# EAGLE design UWB AOA with Display STM32F103C8T6 V1.1 (EAGLE 6.1)
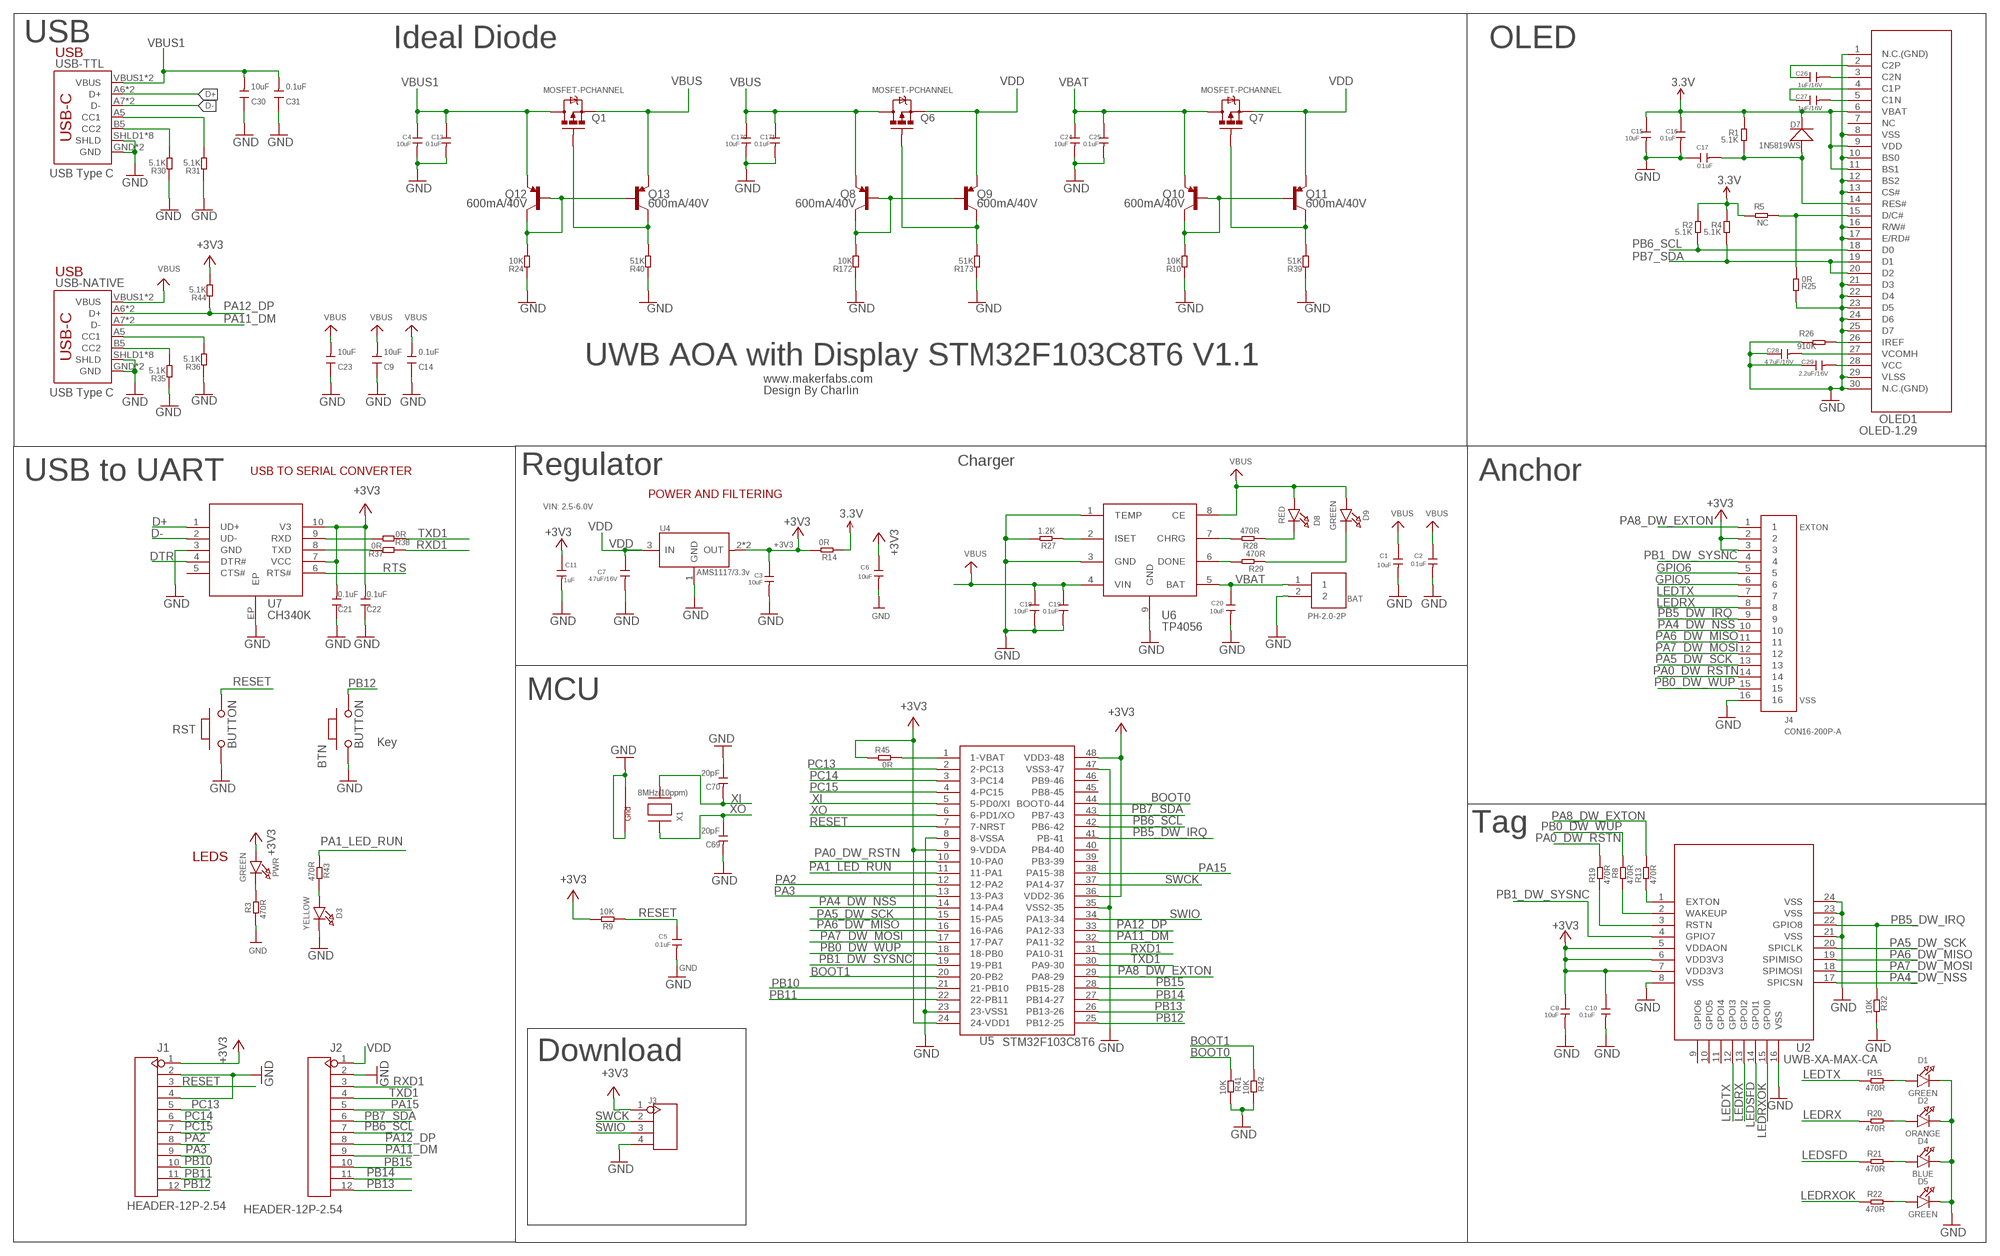
[diagram p0: schematic, sheet 1]

## Parts
BAT  PH-2.0-2P  [PH-2.0-2P]
BTN  BUTTON  PB157  [157SW]
C1  10uF  C-0603  [C0603]
C2  0.1uF  C-0603  [C0603]
C3  10uF  C-0603  [C0603]
C4  10uF  C-0603  [C0603]
C5  0.1uF  C-0603  [C0603]
C6  10uF  C-0603  [C0603]
C7  4.7uF/16V  C-0603  [C0603]
C8  10uF  C-0603  [C0603]
C9  10uF  DISCRETE_C-0603  [DISCRETE_C0603]
C10  0.1uF  C-0603  [C0603]
C11  1uF  C-0603  [C0603]
C13  0.1uF  C-0603  [C0603]
C14  0.1uF  DISCRETE_C-0603  [DISCRETE_C0603]
C15  10uF  C-0603  [C0603]
C16  0.1uF  C-0603  [C0603]
C17  0.1uF  C-0603  [C0603]
C18  10uF  C-0603  [C0603]
C19  0.1uF  C-0603  [C0603]
C20  10uF  C-0603  [C0603]
C21  0.1uF  DISCRETE_C-0603  [DISCRETE_C0603]
C22  0.1uF  DISCRETE_C-0603  [DISCRETE_C0603]
C23  10uF  DISCRETE_C-0603  [DISCRETE_C0603]
C24  10uF  C-0603  [C0603]
C25  0.1uF  C-0603  [C0603]
C26  1uF/16V  C-0603  [C0603]
C27  1uF/16V  C-0603  [C0603]
C28  4.7uF/16V  C-0603  [C0603]
C29  2.2uF/16V  C-0603  [C0603]
C30  10uF  DISCRETE_C-0603  [DISCRETE_C0603]
C31  0.1uF  DISCRETE_C-0603  [DISCRETE_C0603]
C69  20pF  DISCRETE_C-0402  [DISCRETE_C0402]
C70  20pF  DISCRETE_C-0402  [DISCRETE_C0402]
C170  10uF  C-0603  [C0603]
C171  0.1uF  C-0603  [C0603]
D1  GREEN  LED0805_NOOUTLINE  [CHIPLED_0805_NOOUTLINE]
D2  ORANGE  LED0805_NOOUTLINE  [CHIPLED_0805_NOOUTLINE]
D3  YELLOW  LED0805_NOOUTLINE  [CHIPLED_0805_NOOUTLINE]
D4  BLUE  LED0805_NOOUTLINE  [CHIPLED_0805_NOOUTLINE]
D5  GREEN  LED0805_NOOUTLINE  [CHIPLED_0805_NOOUTLINE]
D7  1N5819WS  D'0805'  [SOD323]
D8  RED  LED0805_NOOUTLINE  [CHIPLED_0805_NOOUTLINE]
D9  GREEN  LED0805_NOOUTLINE  [CHIPLED_0805_NOOUTLINE]
J1  HEADER-12P-2.54  [12P-2.54]
J2  HEADER-12P-2.54  [12P-2.54]
J3  HEADER-4P-60/35MILROUND  [4P-65/35ROUND]
J4  CON16-200P-A  [THD16-200P-3250L240W430H]
OLED1  OLED-1.29  [OLED-1.29]
PWR  GREEN  LED0805_NOOUTLINE  [CHIPLED_0805_NOOUTLINE]
Q1  MOSFET-PCHANNEL  [SOT23-3]
Q6  MOSFET-PCHANNEL  [SOT23-3]
Q7  MOSFET-PCHANNEL  [SOT23-3]
Q8  600mA/40V  TRANS_PNP-MMBT4403  [SOT23-3]
Q9  600mA/40V  TRANS_PNP-MMBT4403  [SOT23-3]
Q10  600mA/40V  TRANS_PNP-MMBT4403  [SOT23-3]
Q11  600mA/40V  TRANS_PNP-MMBT4403  [SOT23-3]
Q12  600mA/40V  TRANS_PNP-MMBT4403  [SOT23-3]
Q13  600mA/40V  TRANS_PNP-MMBT4403  [SOT23-3]
R1  5.1K  R-0603  [R0603]
R2  5.1K  R-0603  [R0603]
R3  470R  R-0603  [R0603]
R4  5.1K  R-0603  [R0603]
R5  NC  R-0603  [R0603]
R8  470R  R-0603  [R0603]
R9  10K  R-0603  [R0603]
R10  10K  DISCRETE_R-0603  [DISCRETE_R0603]
R13  470R  R-0603  [R0603]
R14  0R  R-0603  [R0603]
R15  470R  R-0603  [R0603]
R19  470R  R-0603  [R0603]
R20  470R  R-0603  [R0603]
R21  470R  R-0603  [R0603]
R22  470R  R-0603  [R0603]
R24  10K  DISCRETE_R-0603  [DISCRETE_R0603]
R25  0R  R-0603  [R0603]
R26  910K  R-0603  [R0603]
R27  1.2K  R-0603  [R0603]
R28  470R  R-0603  [R0603]
R29  470R  R-0603  [R0603]
R30  5.1K  DISCRETE_R-0603  [DISCRETE_R0603]
R31  5.1K  DISCRETE_R-0603  [DISCRETE_R0603]
R32  10K  R-0603  [R0603]
R35  5.1K  DISCRETE_R-0603  [DISCRETE_R0603]
R36  5.1K  DISCRETE_R-0603  [DISCRETE_R0603]
R37  0R  R-0603  [R0603]
R38  0R  R-0603  [R0603]
R39  51K  DISCRETE_R-0603  [DISCRETE_R0603]
R40  51K  DISCRETE_R-0603  [DISCRETE_R0603]
R41  10K  R-0603  [R0603]
R42  10K  R-0603  [R0603]
R43  470R  R-0603  [R0603]
R44  5.1K  DISCRETE_R-0603  [DISCRETE_R0603]
R45  0R  R-0603  [R0603]
R172  10K  DISCRETE_R-0603  [DISCRETE_R0603]
R173  51K  DISCRETE_R-0603  [DISCRETE_R0603]
RST  BUTTON  PB157  [157SW]
U2  UWB-XA-MAX-CA  [UWB-X1-MAK-CA]
U4  AMS1117/3.3v  LD1117'SOT89'  [SOT89]
U5  STM32F103C8T6  [LQFP48-50P-900L900W160H]
U6  TP4056  [SOP8-1.27P]
U7  CH340K  [ESOP-10-EP-150MIL]
USB-NATIVE  USB_C5  [USB-C-16P-5]
USB-TTL  USB_C5  [USB-C-16P-5]
X1  8MHz(10ppm)  XTAL-4-3225  [NX3225]

## Nets
3.3V: C15.1 C16.1 D7.- OLED1.6(VBAT) OLED1.9(VDD) OLED1.11(BS1) R1.2 R2.2 R4.2 R5.2 R14.1
+3V3: C3.1 C6.1 C8.1 C10.1 C11.1 C21.2 C22.2 J1.1 J3.1 J4.2 J4.3 PWR.A R9.2 R14.2 R44.2 R45.1 U2.5(VDDAON) U2.6(VDD3V3) U2.7(VDD3V3) U4.2(OUT) U4.4(OUT) U5.9(9-VDDA) U5.24(24-VDD1) U5.36(VDD2-36) U5.48(VDD3-48) U7.7(VCC) U7.10(V3)
BOOT0: R41.1 U5.44(BOOT0-44)
BOOT1: R42.1 U5.20(20-PB2)
D+: U7.1(UD+) USB-TTL.A6(D+) USB-TTL.B6(D+)
D-: U7.2(UD-) USB-TTL.A7(D-) USB-TTL.B7(D-)
DTR: U7.4(DTR#)
GND: BAT.2 BTN.1 C1.2 C2.2 C3.2 C4.2 C5.2 C6.2 C7.2 C8.2 C9.1 C10.2 C11.2 C13.2 C14.1 C15.2 C16.2 C17.1 C18.2 C19.2 C20.2 C21.1 C22.1 C23.1 C24.2 C25.2 C28.1 C29.1 C30.1 C31.1 C69.2 C70.1 C170.2 C171.2 D1.C D2.C D3.C D4.C D5.C J1.2 J1.4 J2.2 J3.4 J4.16 OLED1.1(N.C.(GND)) OLED1.8(VSS) OLED1.10(BS0) OLED1.12(BS2) OLED1.13(CS#) OLED1.16(R/W#) OLED1.17(E/RD#) OLED1.21(D3) OLED1.22(D4) OLED1.23(D5) OLED1.24(D6) OLED1.25(D7) OLED1.29(VLSS) OLED1.30(N.C.(GND)) R3.1 R10.1 R24.1 R25.2 R26.2 R27.2 R30.1 R31.1 R32.2 R35.1 R36.1 R39.1 R40.1 R41.2 R42.2 R172.1 R173.1 RST.1 U2.8(VSS) U2.16(VSS) U2.21(VSS) U2.23(VSS) U2.24(VSS) U4.1(GND) U5.8(8-VSSA) U5.23(23-VSS1) U5.35(VSS2-35) U5.47(VSS3-47) U6.1(TEMP) U6.3(GND) U6.9(GND) U7.3(GND) U7.EP USB-NATIVE.GND USB-NATIVE.GND2(GND) USB-NATIVE.SHLD1(SHLD) USB-NATIVE.SHLD2(SHLD) USB-NATIVE.SHLD3(SHLD) USB-NATIVE.SHLD4(SHLD) USB-NATIVE.SHLD5(SHLD) USB-NATIVE.SHLD6(SHLD) USB-NATIVE.SHLD7(SHLD) USB-NATIVE.SHLD8(SHLD) USB-TTL.GND USB-TTL.GND2(GND) USB-TTL.SHLD1(SHLD) USB-TTL.SHLD2(SHLD) USB-TTL.SHLD3(SHLD) USB-TTL.SHLD4(SHLD) USB-TTL.SHLD5(SHLD) USB-TTL.SHLD6(SHLD) USB-TTL.SHLD7(SHLD) USB-TTL.SHLD8(SHLD) X1.2(G2) X1.4(G1)
GPIO5: J4.6
GPIO6: J4.5
LEDRX: J4.8 R20.1 U2.13(GPOI2)
LEDRXOK: R22.1 U2.15(GPOI0)
LEDSFD: R21.1 U2.14(GPOI1)
LEDTX: J4.7 R15.1 U2.12(GPOI3)
N$1: D1.A R15.2
N$3: C17.2 D7.+ OLED1.14(RES#) R1.1
N$4: OLED1.15(D/C#) R5.1 R25.1
N$5: PWR.C R3.2
N$6: C28.2 OLED1.27(VCOMH)
N$7: C26.2 OLED1.3(C2N)
N$8: C29.2 OLED1.28(VCC)
N$9: OLED1.26(IREF) R26.1
N$10: R13.1 U2.1(EXTON)
N$11: R8.1 U2.2(WAKEUP)
N$12: R19.1 U2.3(RSTN)
N$15: Q10.1(B) Q10.3(C) Q11.1(B) R10.2
N$16: D2.A R20.2
N$17: D4.A R21.2
N$18: D5.A R22.2
N$19: C26.1 OLED1.2(C2P)
N$21: C27.1 OLED1.4(C1P)
N$22: C27.2 OLED1.5(C1N)
N$23: R27.1 U6.2(ISET)
N$24: D3.A R43.2
N$25: R31.2 USB-TTL.A5(CC1)
N$26: R30.2 USB-TTL.B5(CC2)
N$28: R45.2 U5.1(1-VBAT)
N$29: R28.2 U6.7(CHRG)
N$30: R29.2 U6.6(DONE)
N$31: D8.C R28.1
N$32: D9.C R29.1
N$33: R36.2 USB-NATIVE.A5(CC1)
N$34: R35.2 USB-NATIVE.B5(CC2)
N$36: Q7.1(G) Q11.3(C) R39.2
N$37: Q12.1(B) Q12.3(C) Q13.1(B) R24.2
N$42: Q1.1(G) Q13.3(C) R40.2
N$46: R38.2 U7.9(RXD)
N$49: R37.2 U7.8(TXD)
N$66: Q8.1(B) Q8.3(C) Q9.1(B) R172.2
N$90: Q6.1(G) Q9.3(C) R173.2
PA0_DW_RSTN: J4.14 R19.2 U5.10(10-PA0)
PA1_LED_RUN: R43.1 U5.11(11-PA1)
PA2: J1.8 U5.12(12-PA2)
PA3: J1.9 U5.13(13-PA3)
PA4_DW_NSS: J4.10 U2.17(SPICSN) U5.14(14-PA4)
PA5_DW_SCK: J4.13 U2.20(SPICLK) U5.15(15-PA5)
PA6_DW_MISO: J4.11 U2.19(SPIMISO) U5.16(16-PA6)
PA7_DW_MOSI: J4.12 U2.18(SPIMOSI) U5.17(17-PA7)
PA8_DW_EXTON: J4.1 R13.2 U5.29(PA8-29)
PA11_DM: J2.9 U5.32(PA11-32) USB-NATIVE.A7(D-) USB-NATIVE.B7(D-)
PA12_DP: J2.8 R44.1 U5.33(PA12-33) USB-NATIVE.A6(D+) USB-NATIVE.B6(D+)
PA15: J2.5 U5.38(PA15-38)
PB0_DW_WUP: J4.15 R8.2 U5.18(18-PB0)
PB1_DW_SYSNC: J4.4 U2.4(GPIO7) U5.19(19-PB1)
PB5_DW_IRQ: J4.9 R32.1 U2.22(GPIO8) U5.41(PB-41)
PB6_SCL: J2.7 OLED1.18(D0) R2.1 U5.42(PB6-42)
PB7_SDA: J2.6 OLED1.19(D1) OLED1.20(D2) R4.1 U5.43(PB7-43)
PB10: J1.10 U5.21(21-PB10)
PB11: J1.11 U5.22(22-PB11)
PB12: BTN.2 J1.12 U5.25(PB12-25)
PB13: J2.12 U5.26(PB13-26)
PB14: J2.11 U5.27(PB14-27)
PB15: J2.10 U5.28(PB15-28)
PC13: J1.5 U5.2(2-PC13)
PC14: J1.6 U5.3(3-PC14)
PC15: J1.7 U5.4(4-PC15)
RESET: C5.1 J1.3 R9.1 RST.2 U5.7(7-NRST)
RTS: U7.6(RTS#)
RXD1: J2.3 R37.1 U5.31(PA10-31)
SWCK: J3.2 U5.37(PA14-37)
SWIO: J3.3 U5.34(PA13-34)
TXD1: J2.4 R38.1 U5.30(PA9-30)
VBAT: BAT.1 C20.1 C24.1 C25.1 Q7.3(D) Q10.2(E) U6.5(BAT)
VBUS: C1.1 C2.1 C9.2 C14.2 C18.1 C19.1 C23.2 C170.1 C171.1 D8.A D9.A Q1.2(S) Q6.3(D) Q8.2(E) Q13.2(E) U6.4(VIN) U6.8(CE) USB-NATIVE.VBUS1(VBUS) USB-NATIVE.VBUS2(VBUS)
VBUS1: C4.1 C13.1 C30.2 C31.2 Q1.3(D) Q12.2(E) USB-TTL.VBUS1(VBUS) USB-TTL.VBUS2(VBUS)
VDD: C7.1 J2.1 Q6.2(S) Q7.2(S) Q9.2(E) Q11.2(E) U4.3(IN)
XI: C70.2 U5.5(5-PD0/XI) X1.3(X2)
XO: C69.1 U5.6(6-PD1/XO) X1.1(X1)
Unconnected: OLED1.7(NC) U2.9(GPIO6) U2.10(GPIO5) U2.11(GPOI4) U5.39(PB3-39) U5.40(PB4-40) U5.45(PB8-45) U5.46(PB9-46) U7.5(CTS#)

## Notes on the sheet
- USB | Ideal Diode | OLED
- USB
- USB Type C
- USB
- UWB AOA with Display STM32F103C8T6 V1.1
- www.makerfabs.com
- USB Type C | Design By Charlin
- Charger
- USB TO SERIAL CONVERTER | Regulator
- USB to UART | Anchor
- POWER AND FILTERING
- VIN: 2.5-6.0V
- MCU
- Key
- Tag
- LEDS
- Download

## Library data of the parts
BAT = Connector:PH-2.0-2P
BTN RST = MySMD:PB157
C1-C8 C10 C11 C13 C15-C20 C24-C29 C170 C171 = Discrete:C*: Ceramic Capacitors
C9 C14 C21-C23 C30 C31 C69 C70 = A9G:DISCRETE_C*: Ceramic Capacitors
D1-D5 D8 D9 PWR = microbuilder:LED: LED 0603 - 0603 Surface Mount Package 2mA: Green LED - Low Power (3.9mcd, 2ma, 1.7Vf) - Digikey: 475-2709-2-ND Orange LED - Low Power (9.8mcd, 2ma, 1.8Vf) - Digikey: 475-1194-2-ND Red LED - Low Power (5mcd, 2ma, 1.8Vf) - Digikey: 475-1195-2-ND Yellow LED - Low Power (7mcd, 2ma, 1.8Vf) - Digikey: 475-1196-2-ND 5mA: Blue LED - Low Power (17mcd, 5ma, 2.9Vf) - Digikey: LNJ937W8CRACT-ND 0805 - 0805 Surface Mount Package 2mA: Red LED (8.8mcd, 2mA, 1.8Vf, Clear) - Low Power [Digikey: 475-2510-1-ND] Green LED (5mcd, 2mA, 1.8Vf, Clear) - Low Power [Digikey: 475-2730-1-ND] Yellow LED (11.3mcd, 2mA, 1.8Vf, Clear) - Low Power [Digikey: 475-2555-1-ND] 20mA: Red LED (104mcd, 20mA, Diffused) - LS R976 [Digikey: 475-1278-6-ND] Red LED (12mcd, 20mA, 2.0Vf, Clear) - APT2012EC [Digikey: 754-1128-1-ND] Green LED (15mcd, 20mA, 2.2Vf, Clear) - APT2012GC [Digikey: 754-1131-1-ND] Orange LED (160mcd, 20mA, 2.1Vf, Clear) - APT2012SECK [Digikey: 754-1130-1-ND] 1206 - 1206 Surface Mount Package Green LED (26mcd, 20mA, Diffused) - LG N971 [Digikey: 475-1407-6-ND] Red LED (15mcd, 20mA, Diffused) - LH N974 [Digikey: 475-1416-6-ND] Cree - Cree High-Power Surface Mount LEDs XPEBWT-L1-0000-00D50 - White 111lm 350mA 2.9Vf 6200K 110° XTEAWT-00-0000-00000LEE3 - White 114lm 350mA 2.85Vf 5000K 115° Everlight - Everlight 45-21 Series Surface Mount LEDs 45-21/QK2C-B2832AC2CB2/2T - Warm White 2000mcd 20mA 3.25Vf 3050K 120° 45-21/LK2C-B38452C4CB2/2T - Nuetral White 2000mcd 20mA 3.25Vf 4150K 120° 45-21/LK2C-B50634C6CB2/2T - Cold White 2200mcd 20mA 3.25Vf 5650K 120° PLCC2 Reverse Mount LS T77K-J1L2-1-0-2-R18-Z - Red 11.25mcd 2mA 1.8Vf 630nm 120° LO T77K-L1M2-24-Z - Orange 19.6mcd 2mA 1.8Vf 606nm 120° LY T77K-K2M1-26-Z - Yellow 15.7mcd 2mA 1.8Vf 587nm 120°
D7 = Discrete:D*
J1 J2 = Connector:HEADER-12P
J3 = Connector:HEADER-4P
J4 = user:CON16-200P-A
OLED1 = sale:OLED-1.29
Q1 Q6 Q7 = User-Submitted:MOSFET-PCHANNEL: Generic PMOSFET IRLML2244 - TRANS-11153 (SOT-23 -20V -4.3A) (1.Gate 2.Source 3.Drain) FQP27P06 - COM-10349 <http://www.sparkfun.com/products/10349> (TO-220 -60V -27A) (1.Gate 2.Source 3.Drain); PROD_ID: TRANS-08285
Q8-Q13 = SparkFun-DiscreteSemi:TRANS_PNP: PNP transistor Current controlled devices typically used to amplify current or used as a switch. SparkFun Products: SparkFun Serial Enabled 16x2 LCD - Red on Black <https://www.sparkfun.com/products/9068> SparkFun Logomatic <https://www.sparkfun.com/products/12772>; PROD_ID: TRANS-09245
R1-R5 R8 R9 R13-R15 R19-R22 R25-R29 R32 R37 R38 R41-R43 R45 = Discrete:R*
R10 R24 R30 R31 R35 R36 R39 R40 R44 R172 R173 = A9G:DISCRETE_R*
U2 = sale:UWB-XA-MAX-CA
U4 = IC:LD1117: Low Drop Fixed And Adjustable Positive Voltage Regulators http://www.datasheetcatalog.org/datasheet/SGSThomsonMicroelectronics/mXuqtqv.pdf
U5 = user:STM32F103C8T6
U6 = self:TP4056
U7 = sale:CH340K
USB-NATIVE USB-TTL = USBC:USB_C: USB Type C 16Pin Connector Super Speed pins not available on the 16-pin purely SMD connector so this part is best for USB 2.0 implementations. D1 and D2 are tied together enabling D+/- no matter which way the cable is plugged into the connector. The two channel configuration pins (CC1/2) are exposed. These are normally connected to ground via 5.1k resistors but can be reconfigured for high current/high power applications.
X1 = adafruit:XTAL-4: Classic 4-pin 3.2 x 2.5mm crystal

## Net classes
0 default: width 0.203 mm

## Board
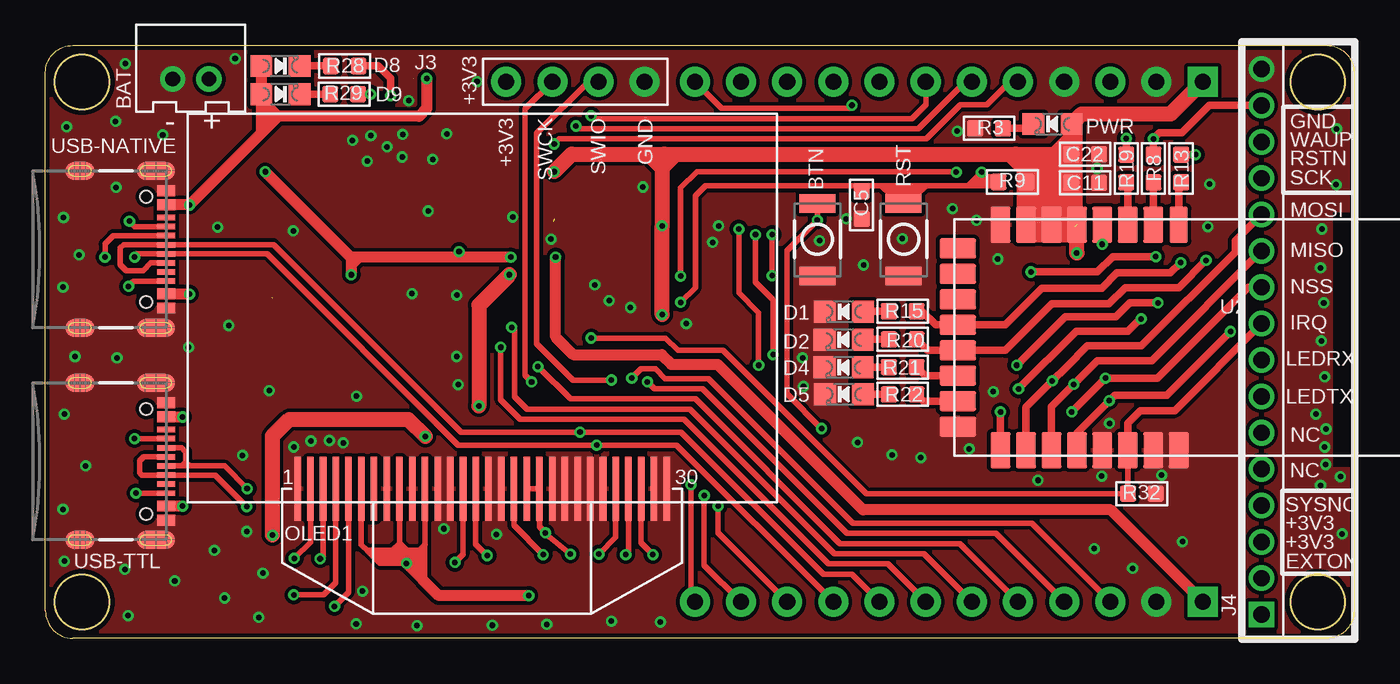
[diagram p1: board, top side]
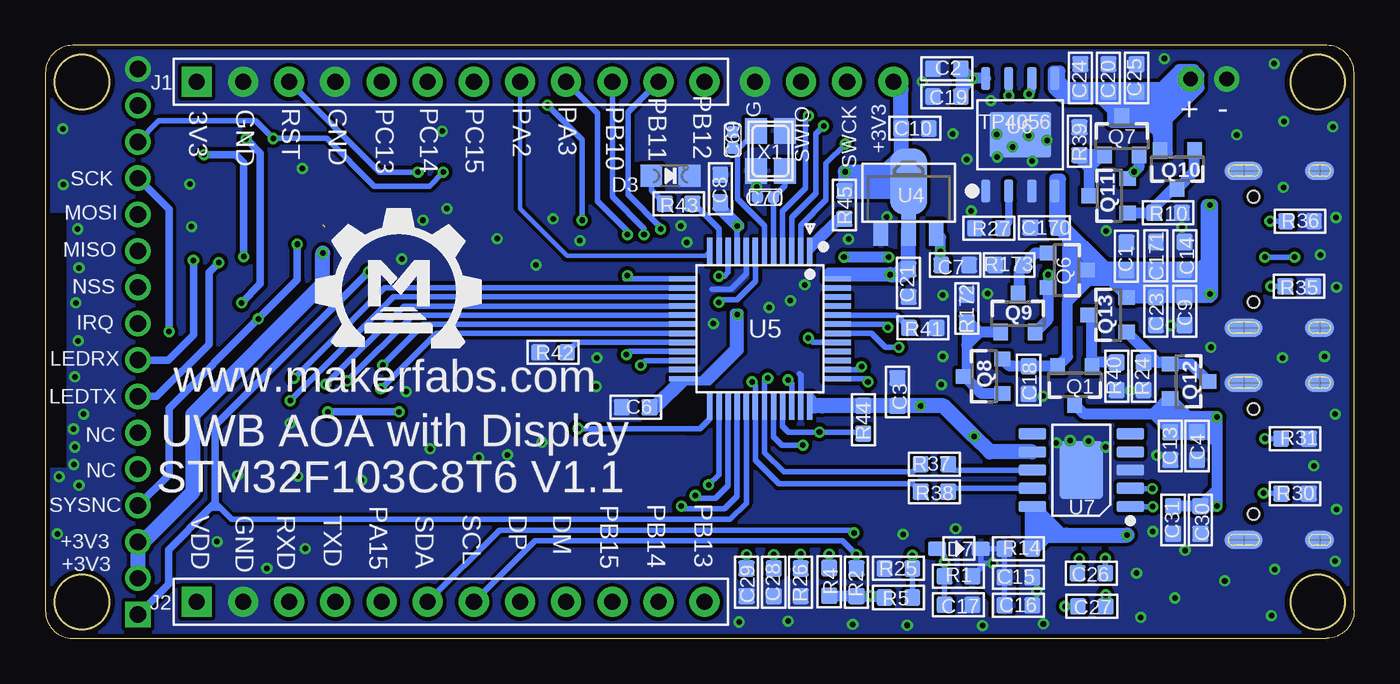
[diagram p2: board, bottom side, seen from below]

Size 72 x 32.6 mm. Coordinates in mm from the lower left corner, seen from the top.
Outline: 72,31.1 72,1.5 arc-90 70.5,0 1.5,0 arc-90 0,1.5 0,31.1 arc-90 1.5,32.6 70.5,32.6 arc-90 72,31.1
Outline: circle at 2,2 radius 1.5
Outline: circle at 2,30.6 radius 1.5
Outline: circle at 70,30.6 radius 1.5
Outline: circle at 70,2 radius 1.5
Copper layers (1*16): Top 0.035mm / dielectric 1.5mm / Bottom 0.035mm
Design rules: minimum track width 10mil, minimum drill 10mil, track to track 8mil, track to pad 8mil, pad to pad 8mil, via to via 8mil, smd to smd 0mil, copper to edge 10mil, drill to drill 8mil, minimum pad ring 10mil, minimum via ring 6mil, stop-mask expansion 4mil, vias tented up to drill 100mil, thermal gap 0mil
tRestrict: area 70.9,9.4 to 72.5,23.4
bRestrict: area 70.9,9.4 to 72.5,23.4

### Footprints (pad centres in the part's own frame; a part is rotated, then mirrored left to right if it is on the bottom)
PH-2.0-2P = drill 0.8 pad 1.4: 1 -1,0; 2 1,0
157SW = smd 1.016 x 1.981: 1 0,0; 2 4,0
C0603 = smd 0.889 x 0.889: 1 -0.762,0; 2 0.762,0
DISCRETE_C0603 = smd 0.889 x 0.889: 1 -0.762,0; 2 0.762,0
DISCRETE_C0402 = smd 0.635 x 0.635: 1 -0.445,0; 2 0.445,0
CHIPLED_0805_NOOUTLINE = smd 1.2 x 1.2: A 0,-1.05; C 0,1.05
SOD323 = smd 1 x 0.8: + -1.2,0; - 1.2,0
12P-2.54 = drill 0.889 pad 1.651 square: 1 0,13.97 | drill 0.889 pad 1.651: 2 0,11.43; 3 0,8.89; 4 0,6.35; 5 0,3.81; 6 0,1.27; 7 0,-1.27; 8 0,-3.81; 9 0,-6.35; 10 0,-8.89; 11 0,-11.43; 12 0,-13.97
4P-65/35ROUND = drill 0.889 pad 1.651: 1 0,3.81; 2 0,1.27; 3 0,-1.27; 4 0,-3.81
THD16-200P-3250L240W430H = drill 0.9 square: 1 -15,0 | drill 0.9: 2 -13,0; 3 -11,0; 4 -9,0; 5 -7,0; 6 -5,0; 7 -3,0; 8 -1,0; 9 1,0; 10 3,0; 11 5,0; 12 7,0; 13 9,0; 14 11,0; 15 13,0; 16 15,0
OLED-1.29 = smd 0.4 x 3.5: 1 -10.15,-9.94; 2 -9.45,-9.94; 3 -8.75,-9.94; 4 -8.05,-9.94; 5 -7.35,-9.94; 6 -6.65,-9.94; 7 -5.95,-9.94; 8 -5.25,-9.94; 9 -4.55,-9.94; 10 -3.85,-9.94; 11 -3.15,-9.94; 12 -2.45,-9.94; 13 -1.75,-9.94; 14 -1.05,-9.94; 15 -0.35,-9.94; 16 0.35,-9.94; 17 1.05,-9.94; 18 1.75,-9.94; 19 2.45,-9.94; 20 3.15,-9.94; 21 3.85,-9.94; 22 4.55,-9.94; 23 5.25,-9.94; 24 5.95,-9.94; 25 6.65,-9.94; 26 7.35,-9.94; 27 8.05,-9.94; 28 8.75,-9.94; 29 9.45,-9.94; 30 10.15,-9.94
SOT23-3 = smd 0.8 x 0.9: 1 -0.95,-1; 2 0.95,-1; 3 0,1.1
R0603 = smd 0.889 x 0.889: 1 -0.762,0; 2 0.762,0
DISCRETE_R0603 = smd 0.889 x 0.889: 1 -0.762,0; 2 0.762,0
UWB-X1-MAK-CA = smd 2 x 1: 1 -6.2,-3.65 | smd 2 x 1.1: 2 -6.2,-5.05; 3 -6.2,-6.45; 4 -6.2,-7.85; 5 -6.2,-9.25; 6 -6.2,-10.65; 7 -6.2,-12.05; 8 -6.2,-13.45; 17 6.2,-13.45; 18 6.2,-12.05; 19 6.2,-10.65; 20 6.2,-9.25; 21 6.2,-7.85; 22 6.2,-6.45; 23 6.2,-5.05; 24 6.2,-3.65 | smd 1.1 x 2: 9 -4.9,-15.8; 10 -3.5,-15.8; 11 -2.1,-15.8; 12 -0.7,-15.8; 13 0.7,-15.8; 14 2.1,-15.8; 15 3.5,-15.8; 16 4.9,-15.8
SOT89 = smd 0.8 x 1.4: 1 -1.524,-1.905; 3 1.524,-1.905 | smd 0.8 x 1.9: 2 0,-1.651 | smd 2.032 x 3.65: 4 0,0.94
LQFP48-50P-900L900W160H = smd 0.3 x 1.5: 1 -2.75,-4.25; 2 -2.25,-4.25; 3 -1.75,-4.25; 4 -1.25,-4.25; 5 -0.75,-4.25; 6 -0.25,-4.25; 7 0.25,-4.25; 8 0.75,-4.25; 9 1.25,-4.25; 10 1.75,-4.25; 11 2.25,-4.25; 12 2.75,-4.25; 25 2.75,4.25; 26 2.25,4.25; 27 1.75,4.25; 28 1.25,4.25; 29 0.75,4.25; 30 0.25,4.25; 31 -0.25,4.25; 32 -0.75,4.25; 33 -1.25,4.25; 34 -1.75,4.25; 35 -2.25,4.25; 36 -2.75,4.25 | smd 1.5 x 0.3: 13 4.25,-2.75; 14 4.25,-2.25; 15 4.25,-1.75; 16 4.25,-1.25; 17 4.25,-0.75; 18 4.25,-0.25; 19 4.25,0.25; 20 4.25,0.75; 21 4.25,1.25; 22 4.25,1.75; 23 4.25,2.25; 24 4.25,2.75; 37 -4.25,2.75; 38 -4.25,2.25; 39 -4.25,1.75; 40 -4.25,1.25; 41 -4.25,0.75; 42 -4.25,0.25; 43 -4.25,-0.25; 44 -4.25,-0.75; 45 -4.25,-1.25; 46 -4.25,-1.75; 47 -4.25,-2.25; 48 -4.25,-2.75
SOP8-1.27P = smd 1.27 x 0.51: 1 -3.1,1.905; 2 -3.1,0.635; 3 -3.1,-0.635; 4 -3.1,-1.905; 5 3.1,-1.905; 6 3.1,-0.635; 7 3.1,0.635; 8 3.1,1.905 | smd 2.5 x 3.4: 9 0,0
ESOP-10-EP-150MIL = smd 1.5 x 0.6: 1 -2.7,2; 2 -2.7,1; 3 -2.7,0; 4 -2.7,-1; 5 -2.7,-2; 6 2.7,-2; 7 2.7,-1; 8 2.7,0; 9 2.7,1; 10 2.7,2 | smd 2.4 x 3.2: EP 0,0
USB-C-16P-5 = smd 0.3 x 1: A5 -1.25,-0.34; A6 -0.25,-0.34; A7 0.25,-0.34; A8 1.25,-0.34; B5 1.75,-0.34; B6 0.75,-0.34; B7 -0.75,-0.34; B8 -1.75,-0.34 | smd 0.6 x 1: GND -3.225,-0.34; GND2 3.225,-0.34; VBUS1 -2.45,-0.34; VBUS2 2.45,-0.34 | smd 1 x 2.1: SHLD1 -4.32,-0.915; SHLD2 4.32,-0.915 | smd 1 x 2.1 bottom: SHLD3 -4.32,-0.915; SHLD4 4.32,-0.915 | smd 1 x 1.6: SHLD5 -4.32,-5.095; SHLD8 4.32,-5.095 | smd 1 x 1.6 bottom: SHLD6 -4.32,-5.095; SHLD7 4.32,-5.095 | hole 0.65: -2.89,-1.445; 2.89,-1.445
NX3225 = smd 1.4 x 1.2: 1 -1.1,-0.8; 2 1.1,-0.8; 3 1.1,0.8; 4 -1.1,0.8

### Placement (x,y rotation side)
BAT  8,30.75 180 top
BTN  42.47,19.91 90 top
C1  12.52,21.01 90 bottom
C2  22.4,31.32 180 bottom
C3  25.12,13.54 90 bottom
C4  8.64,10.57 270 bottom
C5  44.91,23.83 270 top
C6  39.52,12.7 180 bottom
C7  21.95,20.52 0 bottom
C8  34.87,24.73 90 bottom
C9  9.32,17.98 90 bottom
C10  24.16,28.04 0 bottom
C11  57.2,25.04 0 top
C13  10.11,10.57 270 bottom
C14  9.32,21.03 270 bottom
C15  18.47,3.35 0 bottom
C16  18.47,1.8 0 bottom
C17  21.77,1.83 180 bottom
C18  17.91,14.2 270 bottom
C19  22.4,29.79 180 bottom
C20  13.51,30.81 90 bottom
C21  24.51,19.53 90 bottom
C22  57.2,26.62 180 top
C23  10.9,17.98 90 bottom
C24  15.06,30.81 90 bottom
C25  11.96,30.81 90 bottom
C26  14.45,3.58 180 bottom
C27  14.43,1.75 180 bottom
C28  31.93,3.07 90 bottom
C29  33.43,3.07 90 bottom
C30  8.46,6.5 90 bottom
C31  9.96,6.5 90 bottom
C69  34.19,27.4 90 bottom
C70  32.38,24.26 0 bottom
C170  17.04,22.58 180 bottom
C171  10.9,21.03 90 bottom
D1  43.93,17.96 90 top
D2  43.92,16.42 90 top
D3  37.62,25.43 270 bottom
D4  43.91,14.9 90 top
D5  43.93,13.42 90 top
D7  21.74,4.93 0 bottom
D8  12.93,31.47 270 top
D9  12.93,29.92 270 top
J1  49.7,30.6 90 bottom
J2  49.7,2 90 bottom
J3  29.16,30.61 90 top
J4  66.9,16.3 90 top
OLED1  24.03,18.16 0 top
PWR  55.41,28.28 90 top
Q1  15.37,13.94 180 bottom
Q6  15.82,20.24 270 bottom
Q7  12.78,27.58 0 bottom
Q8  20.35,14.4 90 bottom
Q9  18.49,17.83 0 bottom
Q10  9.73,25.83 180 bottom
Q11  13.46,24.33 90 bottom
Q12  9.12,14.12 270 bottom
Q13  13.51,17.78 90 bottom
R1  21.77,3.4 0 bottom
R2  27.38,3.07 270 bottom
R3  51.92,28.04 0 top
R4  28.88,3.1 270 bottom
R5  25.07,2.24 180 bottom
R8  60.96,25.83 90 top
R9  53.2,25.09 0 top
R10  10.24,23.39 180 bottom
R13  62.48,25.83 90 top
R14  18.47,4.93 0 bottom
R15  47.17,17.98 180 top
R19  59.46,25.83 90 top
R20  47.17,16.43 180 top
R21  47.17,14.91 180 top
R22  47.17,13.41 180 top
R24  11.58,14.4 90 bottom
R25  25.07,3.84 180 bottom
R26  30.45,3.07 270 bottom
R27  20.09,22.56 180 bottom
R28  16.46,31.47 0 top
R29  16.43,29.92 0 top
R30  3.25,7.95 180 bottom
R31  3.25,10.97 180 bottom
R32  60.33,7.95 0 top
R35  3.02,19.35 180 bottom
R36  2.97,22.94 180 bottom
R37  23.09,9.58 0 bottom
R38  23.09,8.05 0 bottom
R39  15.11,27.33 270 bottom
R40  13.06,14.4 90 bottom
R41  23.72,17.07 0 bottom
R42  44.07,15.72 180 bottom
R43  37.16,23.9 180 bottom
R44  27,12.01 90 bottom
R45  28.04,23.83 270 bottom
R172  21.31,18.14 270 bottom
R173  18.97,20.52 0 bottom
RST  47.22,19.91 90 top
U2  66,16.54 270 top
U4  24.51,24.18 0 bottom
U5  32.69,17.02 180 bottom
U6  18.36,27.69 90 bottom
U7  15.01,9.25 180 bottom
U$1  [MAKERFABS_0.3]  56.69,16.01 0 bottom
USB-NATIVE  6.99,21.39 270 top
USB-TTL  6.99,9.72 270 top
X1  32.11,26.8 270 bottom

### Tracks (layer width: path | path; a pad name or v marks a point on that pad's centre or on a via)
3.3V  (via drill 0.3)
  Top 0.254: 20.17,4.65 19.99,4.65 19.99,4.72
  Top 0.305: OLED1.6 17.38,5.15 17.7,4.83 | OLED1.11 20.88,5.13 20.85,5.11 | OLED1.9 19.48,4.5 v19.86,4.12 | 17.7,4.83 18.41,4.12 v19.86,4.12 | 20.57,4.83 v19.86,4.12 | 17.7,4.83 20.57,4.83 | 20.57,4.83 20.85,5.11 | 20.85,5.11 20.85,3.1 20.65,3.3 20.65,4.67 20.42,4.45 20.42,3.89 20.17,4.14 20.17,4.65 18.11,4.65 18.36,4.39 19.99,4.39 | 19.05,4.8 19.48,5.23 19.99,4.72
  Top 0.61: v26.59,2.34 21.64,2.34 v19.86,4.12
  Bottom 0.305: C16.1 C15.1 R14.1 D7.- 20.54,4.12 | 20.54,4.12 20.54,3.87 R1.2 | v19.86,4.12 20.54,4.12 | 27.41,2.34 R2.2 | R5.2 v26.59,2.34
  Bottom 0.406: 25.83,2.31 R5.2
  Bottom 0.61: R4.2 27.41,2.34 | R2.2 25.83,2.31
  pour Bottom: 18.77,1.45 18.77,5.13 18.97,5.33 21.01,5.33 21.36,4.98 21.36,3.12 21.21,2.97 20.45,2.97 19.79,2.31 19.79,1.45
+3V3  (via drill 0.3)  (1 unrouted)
  Top 0.813: 34.04,26.62 28.96,26.62 v27.99,25.65 | 34.04,26.62 53.39,26.62 | 53.39,26.62 C22.2 | J1.1 61.9,28.83 57.01,28.83 PWR.A 56.44,28.26 C22.2 | 53.39,26.62 53.96,26.05 R9.2 U2.7 U2.6 U2.5 v56.75,21.19 v56.74,21.18 | C11.1 C22.2 | 33.93,25.88 33.93,26.52 34.04,26.62 | v12.5,5.66 12.5,11.12 13.41,12.04 19.96,12.04 v20.9,11.1 | v25.53,19.99 23.85,18.31 v23.85,12.78 | 33.25,26.57 33.93,25.88 | 33.93,25.88 34.65,26.59 | 56.87,22.15 53.85,22.15 53.85,25.83 53.09,26.59 55.52,26.59 56.64,27.71 56.64,22.63 56.21,22.63 55.85,22.99 55.85,25.96 55.73,26.09 54.53,26.09 54.51,26.06 54.51,23.19 54.56,23.19 55.19,23.82 55.19,25.81 55.14,25.86 | v33.93,17.8 v33.93,22.68 33.93,25.88
  Bottom 0.254: 29.77,13.13 29.94,13.13 | 29.94,13.13 U5.36 | 29.94,13.13 29.9,13.13 29.9,13.16 | v33.93,17.8 33.81,17.8 33.81,17.98 | 33.96,22.48 33.93,22.48 v33.93,22.68 v33.94,22.68 | 35.12,23.95 35.1,23.95 35.1,23.9 | C6.1 38.68,12.78 38.68,12.8
  Bottom 0.305: U5.9 v33.94,22.68 33.94,22.76 | 35.12,23.95 C8.1 34.87,23.62 v33.93,22.68 | U5.48 25.04,19.77 C21.2 | C3.1 v23.85,12.78 | 24.69,20.78 25.22,20.24 28.91,20.24 29.03,20.12 29.03,19.79 25.38,19.79 25.17,19.99 | 24.89,20.27 25.17,19.99 | 25.17,19.99 v25.53,19.99 28.83,19.99 | 33.96,22.48 33.83,22.48 33.71,22.61 33.71,22.73 34.98,24 | U5.24 38.51,12.7 C6.1 | 38.63,12.5 38.35,12.5 36.6,14.25 | 36.6,14.25 37.24,14.25 38.68,12.8 | 29.87,13.13 29.9,13.16 29.92,13.18 | 36.6,14.25 35.56,14.25 33.93,15.88 v33.93,17.8 | 36.96,14.05 35.48,14.05 33.73,15.8 33.73,17.91 33.81,17.98 34.11,17.98 34.19,17.91 34.19,15.95 35.84,14.3 | 29.77,13.13 29.77,13.23 | 29.77,13.23 29.9,13.36 | 29.77,13.23 29.31,12.78 29.26,12.78 | 33.93,22.53 34.01,22.53 35.1,23.62 35.1,23.9 35.1,23.98
  Bottom 0.406: U4.2 24.51,24.54 24.51,24.59 U4.4 | 29.77,13.13 29.57,12.93 | U7.10 R14.2 | 16.18,5.66 17.4,5.66 17.93,5.13 17.93,7.32 17.5,7.32 15.85,5.66 16.18,5.66 | 16.18,5.66 17.55,7.04 17.55,5.44 17.58,5.41 17.58,5.51 16.92,6.17 17.22,6.17 17.5,6.45
  Bottom 0.813: J4.2 J4.3 66.62,5.31 63.88,8.05 63.88,12.32 56.74,19.46 v56.74,21.18 | U4.2 C21.2 24.82,19.99 v25.53,19.99 | U7.7 20.05,10.25 v20.9,11.1 22.58,12.78 C3.1 R44.2 29.26,12.78 29.68,12.78 | R14.2 16.97,5.66 15.85,5.66 v12.5,5.66 | J3.1 24.92,30.18 C10.1 24.92,25 24.51,24.59 | 24.51,24.54 24.56,24.59 R45.1 27.99,24.64 v27.99,25.65 25.81,25.65 24.94,26.52 24.94,25.76 25.5,25.2 27.74,25.2 27.76,25.17
BOOT0
  Bottom 0.305: U5.44 25.18,17.77 R41.1
BOOT1
  Bottom 0.305: U5.20 42.76,16.27 R42.1
D+  (via drill 0.3)
  Top 0.305: v11.07,7.24 9.34,8.97 USB-TTL.B6 5.3,8.97 5.18,9.09 5.18,9.75 5.4,9.97 USB-TTL.A6
  Bottom 0.305: v11.07,7.24 U7.1
D-  (via drill 0.3)
  Top 0.305: USB-TTL.A7 7.52,9.47 | 7.52,9.47 9.86,9.47 v11.1,8.23 | USB-TTL.B7 7.49,10.47 7.72,10.24 7.72,9.93 7.72,9.68 | 7.72,9.68 7.52,9.47 | 7.72,9.68 7.92,9.47
  Bottom 0.305: v11.1,8.23 12.29,8.23 U7.2
GND  (via drill 0.3)
  Bottom 0.305: U5.35 30.44,14.49 30.5,14.55 | U5.8 33.44,20.05 34.29,19.2 35.33,19.2
  other vias: 70.15,8.41 44.68,10.77 57.71,4.93 1.04,4.24 24.82,5.71 45.01,20.52 25.7,23.16 31.01,18.57 4.37,3.78 6.45,27.69 17.7,26.24 19.63,26.47 21.92,6.02 22.07,27.74 17.91,27.64 50.16,27.89 9.86,2.21 35.26,17.3 69.9,12.32 70.23,22.5 4.39,31.6 64.06,24.97 1.17,28.12 4.55,1.24 70.21,16.36 1.85,21.08 61.42,8.97 16.89,27.38 71.02,24.94 3.86,28.42 57.86,25.83 71.35,5.74 48.16,9.93 3.94,15.42 2.21,9.47 70.15,20.37 71.04,28.02 10.85,10.06 13.67,10.52 14.61,10.85 15.62,10.87 17.12,13.31 12.32,13.61 10.08,17.2 9.47,22.61 19.66,27.71 18.8,27.03 21.31,26.34 10.44,31.88 20.17,18.95 22.63,18.87 22.63,15.49 22.71,13.94 13.64,22.4 21.06,23.5 32.87,24.82 52.4,20.85 47.14,21.97 42.6,21.87 49.91,23.62 32.18,18.19 30.23,19.43 41.71,13.84 41.66,15.42 46.58,10.08 58.12,8.92 54.61,8.69 50.83,10.41 52.15,13.56 58.55,11.81 62.56,5.31 59.82,3.84 63.96,22.63 23.75,30.61 19.99,29.57 3.89,24.79 1.04,12.32 0.97,7.09 0.97,19.3 0.99,23.14 1.63,15.49 7.87,16 16.38,10.74 33.83,0.89 31.14,0.94 27.58,0.76 24.59,0.71 20.45,0.69 17.09,0.79 17.45,2.59 11.07,5.87 11.96,3.58 7.11,3.15 9.3,4.83 11.73,1.14 51.23,22.99 36.7,21.77 37.03,22.68 44.07,23.06 27.81,21.95 70.33,18.44 70.38,14.38 70.46,11.51 71.25,8.89 70.43,9.55 70.38,10.52
  pour Top (rank 6): -8.51,41 100,41 100,-3.17 -8.52,-3.17 -8.52,37.36
  pour Bottom (rank 6): -2.29,40 99,40 99,-2.54 -2.29,-1.98
LEDRX  (via drill 0.3)
  Top 0.406: R20.1 48.53,15.84 U2.13 52.82,15.84 55.37,18.39 58.52,18.39 59.41,19.28 62.36,19.28 v63.86,20.78
  Bottom 0.406: J4.8 65.24,15.3 63.86,16.69 v63.86,20.78
LEDRXOK
  Top 0.406: U2.15 48.31,13.04 R22.1
LEDSFD
  Top 0.406: U2.14 48.4,14.44 R21.1
LEDTX  (via drill 0.3)
  Top 0.406: R15.1 48.23,17.98 48.98,17.23 U2.12 52.81,17.25 54.81,19.25 58.12,19.25 58.95,20.09 61.9,20.09 v62.46,20.65
  Bottom 0.406: J4.7 65.87,13.3 62.99,16.18 62.99,20.12 v62.46,20.65
N$1
  Top 0.406: R15.2 45,17.98 D1.A
N$3  (via drill 0.3)
  Top 0.305: OLED1.14 22.98,4.61 v22.53,4.17
  Bottom 0.305: C17.2 R1.1 v22.53,4.17 22.53,4.51 D7.+
N$4  (via drill 0.3)
  Top 0.305: OLED1.15 23.68,5.18 v24.31,4.55
  Bottom 0.305: R5.1 v24.31,4.55 R25.1
N$5
  Top 0.406: PWR.C 54.12,28.04 R3.2
N$6  (via drill 0.3)
  Top 0.305: OLED1.27 32.08,4.75 v31.93,4.6
  Bottom 0.305: v31.93,4.6 C28.2
N$7  (via drill 0.3)
  Top 0.305: OLED1.3 15.28,4.53 v15.11,4.37
  Bottom 0.305: v15.11,4.37 15.11,3.68 C26.2
N$8  (via drill 0.3)
  Top 0.305: OLED1.28 32.78,5.25 v33.43,4.6
  Bottom 0.305: v33.43,4.6 C29.2
N$9  (via drill 0.3)
  Top 0.305: OLED1.26 31.38,5.55 v30.45,4.62
  Bottom 0.305: v30.45,4.62 R26.1
N$10
  Top 0.406: U2.1 62.35,24.94 R13.1
N$11
  Top 0.406: U2.2 R8.1
N$12
  Top 0.406: U2.3 59.55,24.98 R19.1
N$15
  Bottom 0.61: 11.31,23.38 R10.2 | 11.31,23.38 9.96,24.73 Q10.3 8.78,25.68 Q10.1 | 11.31,23.38 Q11.1
N$16
  Top 0.406: R20.2 44.98,16.43 D2.A
N$17
  Top 0.406: R21.2 44.98,14.91 D4.A
N$18
  Top 0.406: R22.2 D5.A
N$19  (via drill 0.3)
  Top 0.305: OLED1.2 14.58,5.28 v13.69,4.39
  Bottom 0.305: v13.69,4.39 C26.1
N$21  (via drill 0.3)
  Top 0.305: OLED1.4 15.98,3.05 15.32,2.39 v13.66,2.39
  Bottom 0.305: v13.66,2.39 C27.1
N$22  (via drill 0.3)
  Top 0.305: OLED1.5 16.68,2.53 v15.9,1.75
  Bottom 0.305: v15.9,1.75 C27.2
N$23
  Bottom 0.406: U6.2 19,22.89 R27.1
N$24
  Bottom 0.305: R43.2 38.67,24.65 D3.A
N$25  (via drill 0.3)
  Top 0.305: USB-TTL.A5 v4.9,10.97
  Bottom 0.305: v4.9,10.97 R31.2
N$26  (via drill 0.3)
  Top 0.305: USB-TTL.B5 v4.98,7.97 v4.98,7.98
  Bottom 0.305: v4.98,7.98 4.04,7.98 R30.2
N$28  (1 unrouted)
  Bottom 0.305: U5.1 28.5,22.71 R45.2 | 29.92,21.74 29.87,21.74 28.32,23.29 27.96,22.94
N$29  (via drill 0.3)
  Top 0.406: R28.2 18.32,31.47 U6.7 v19,29.84
  Bottom 0.406: v19,29.84 U6.7
N$30  (via drill 0.3)
  Top 0.406: v17.88,29.92 R29.2
  Bottom 0.406: U6.6 17.73,30.07 v17.88,29.92
N$31
  Top 0.406: R28.1 D8.C
N$32
  Top 0.406: R29.1 D9.C
N$33  (via drill 0.3)
  Top 0.305: USB-NATIVE.A5 4.92,22.64 v4.62,22.94
  Bottom 0.305: R36.2 v4.62,22.94
N$34  (via drill 0.3)
  Top 0.305: USB-NATIVE.B5 4.85,19.64 v4.57,19.36
  Bottom 0.305: R35.2 v4.57,19.36
N$36
  Bottom 0.254: 15.19,26.49 R39.2
  Bottom 0.61: Q7.1 14.55,26.58 | 14.55,26.58 15.1,26.58 R39.2 | Q11.3 14.56,26.58 14.55,26.58 | 13.89,26.64 13.89,26.54 14.58,25.86 14.58,25.88 15.19,26.49
N$37
  Bottom 0.61: Q12.3 8.97,15.07 Q12.1 10.21,15.16 10.69,15.16 10.85,15.16 | 10.85,15.16 R24.2 | Q13.1 10.85,15.16
N$42
  Bottom 0.61: Q13.3 14.42,17.58 Q1.1 14.2,15.16 R40.2
N$46
  Bottom 0.305: U7.9 22.13,8.25 R38.2
N$49
  Bottom 0.305: U7.8 22,9.25 R37.2
N$66
  Bottom 0.61: R172.2 21.31,16.82 | 21.31,16.82 21.31,16.13 | 21.31,16.13 21.31,14.54 Q8.3 20.5,13.45 Q8.1 | Q9.1 21.3,16.83 21.31,16.82 | 21.31,16.13 20.62,16.82 21.23,17.42 21.26,17.42
N$90
  Bottom 0.61: Q6.1 17.54,21.19 R173.2 18.41,20.32 18.41,19.01 Q9.3
PA0_DW_RSTN  (via drill 0.3)
  Top 0.305: v50.11,25.63 50.09,25.65 35.84,25.65 34.95,24.77 v34.95,19.91
  Top 0.406: v59.46,27.48 R19.2
  Bottom 0.305: v50.11,25.63 50.88,24.87 53.92,24.87 56.54,27.48 v59.46,27.48 60.43,28.45 65.76,28.45 J4.14 | U5.10 34.44,20.12 34.65,19.91 v34.95,19.91
PA1_LED_RUN
  Bottom 0.305: U5.11 34.94,22.52 36.32,23.9 R43.1
PA2
  Bottom 0.254: J1.8 45.9,23.62 43.31,21.03 35.64,21.03 35.64,21.08 35.48,21.23 35.47,21.23 U5.12 35.51,21.2
PA3  (via drill 0.3)
  Top 0.305: v39.98,22.2 v39.98,19.94
  Bottom 0.305: v39.98,19.94 40.11,19.77 U5.13 | v39.98,22.2 39.98,22.38 41.63,24.03 41.63,28.88 J1.9
PA4_DW_NSS  (via drill 0.3)
  Top 0.406: J4.10 66.19,19.3 61.19,14.3 59.46,14.3 v58.32,14.3 v56.46,12.45 | v52.55,12.45 U2.17
  Bottom 0.305: U5.14 53.35,19.27 v58.32,14.3
  Bottom 0.406: v56.46,12.45 v52.55,12.45
PA5_DW_SCK  (via drill 0.3)
  Top 0.406: U2.20 56.75,11.28 58.28,12.81 v58.53,13.07 58.83,13.36 61.7,13.36 v65.2,16.87
  Bottom 0.305: U5.15 52.84,18.77 v58.53,13.07
  Bottom 0.406: v65.2,16.87 65.2,23.6 J4.13
PA6_DW_MISO  (via drill 0.3)
  Top 0.406: U2.19 55.35,12.73 v56.58,13.96 57.3,14.68 57.89,15.27 60.87,15.27 J4.11
  Bottom 0.305: U5.16 52.27,18.27 v56.58,13.96
PA7_DW_MOSI  (via drill 0.3)
  Top 0.406: U2.18 53.95,12.7 v55.4,14.15 56.16,14.91 57.33,16.08 60.3,16.08 65.46,21.23 65.46,21.85 J4.12
  Bottom 0.305: U5.17 51.78,17.77 v55.4,14.15
PA8_DW_EXTON  (via drill 0.3)
  Top 0.406: v54.23,20.14 57.89,20.14 58.73,20.98 v61.09,20.98 | R13.2 v63.27,26.59
  Bottom 0.254: 62.38,7.11 62.99,7.11
  Bottom 0.305: 62.66,7.44 61.75,6.53 34.34,6.53 33.44,7.43 U5.29
  Bottom 0.406: J4.1 65.23,2.98 65.23,4.88 62.99,7.11 62.66,7.44 62.66,11.71 v54.23,20.14 | v61.09,20.98 61.09,26.14 61.54,26.59 v63.27,26.59
PA11_DM  (via drill 0.3)
  Top 0.305: J2.9 34.73,10.62 v30.33,10.62 22.71,10.62 12.19,21.13 USB-NATIVE.A7 5.03,21.13 v4.9,20.95 | USB-NATIVE.B7 3.72,22.14 3.28,21.69 v3.28,20.95
  Bottom 0.305: U5.32 31.94,11.09 31.47,10.62 v30.33,10.62 | v3.28,20.95 v4.9,20.95
PA12_DP  (via drill 0.3)
  Top 0.305: USB-NATIVE.A6 12.55,21.64 22.86,11.33 v29.41,11.33 34.98,11.33 42.8,3.5 44.38,3.5 J2.8 | USB-NATIVE.A6 | USB-NATIVE.A6 4.29,21.64 4.12,21.46 4.12,20.55 4.45,20.22 5.38,20.22 5.8,20.64 USB-NATIVE.B6
  Bottom 0.305: U5.33 31.44,11.65 31.11,11.33 v29.41,11.33 27.08,11.33 R44.1
PA15  (via drill 0.3)
  Top 0.305: J2.5 50.3,5.21 43.71,5.21 35.76,13.16 28.88,13.16 v27.1,14.94
  Bottom 0.305: U5.38 27.27,14.77 v27.1,14.94
PB0_DW_WUP  (via drill 0.3)
  Top 0.406: v53.44,15.01 56.11,17.68 58.9,17.68 59.66,18.44 v61.21,18.44 | R8.2 v60.96,27.46 61.29,27.79 62.53,27.79 64.05,29.3 J4.15
  Bottom 0.305: U5.18 51.19,17.27 v53.44,15.01
  Bottom 0.406: v60.96,27.46 60.17,26.67 60.17,19.48 v61.21,18.44
PB1_DW_SYSNC  (via drill 0.3)
  Top 0.406: v53.54,13.72 56.72,16.89 59.56,16.89 60.24,17.56 v60.29,17.56 | U2.4 v58.15,21.68 v58.14,21.67
  Bottom 0.305: U5.19 50.49,16.77 v53.54,13.72
  Bottom 0.406: J4.4 65.2,9 65.2,12.65 v60.29,17.56 58.14,19.71 v58.14,21.67
PB5_DW_IRQ  (via drill 0.3)
  Top 0.305: U2.22 59.56,10.32 R32.1 45.16,7.95 37.29,15.82 34.8,15.82 34.11,16.51 v30.02,16.51
  Top 0.406: U2.22 59.55,11.82 60.25,12.52 62.13,12.52 J4.9
  Bottom 0.305: U5.41 29.78,16.27 v30.02,16.51
PB6_SCL  (via drill 0.3)
  Top 0.305: OLED1.18 25.78,6.2 v27.38,4.6 | J2.7 46.34,4.09 43.08,4.09 35.13,12.04 26.11,12.04 25.04,13.11 v25.04,16
  Bottom 0.305: R2.1 v27.38,4.6 28.14,5.36 45.07,5.36 J2.7 | U5.42 26.55,16.77 25.78,16 v25.04,16
PB7_SDA  (via drill 0.3)
  Top 0.305: OLED1.19 OLED1.20 27.18,6.12 v27.51,5.79 27.69,5.61 v28.88,4.62 | J2.6 48.32,4.65 43.41,4.65 35.46,12.6 26.49,12.6 25.81,13.28 25.81,16.94 v25.65,17.09
  Bottom 0.305: v28.88,4.62 R4.1 | U5.43 25.83,17.27 v25.65,17.09 | J2.6 47.03,5.94 27.66,5.94 v27.51,5.79
PB10  (via drill 0.3)
  Top 0.305: v40.03,15.6 40.03,18.62 39.06,19.58 v39.06,22.2
  Bottom 0.305: U5.21 39.86,15.77 v40.03,15.6 | J1.10 40.81,24.27 39.06,22.53 v39.06,22.2
PB11  (via drill 0.3)
  Top 0.305: v39.24,15.01 39.24,17.91 38.15,19 v38.15,22.5
  Bottom 0.305: U5.22 38.99,15.27 v39.24,15.01 | J1.11 39.95,28.92 39.95,24.41 38.15,22.61 v38.15,22.5
PB12  (via drill 0.3)
  Top 0.305: v42.7,11.53 40.79,13.44 40.79,21.31 v42.47,22.99 BTN.2 | J1.12 37.2,29.13 44.2,29.13 v44.37,29.31
  Bottom 0.305: v42.7,11.53 36.7,11.51 35.99,11.51 35.46,12.04 35.46,12.78 35.46,12.77 U5.25 | v42.47,22.99 42.47,27.41 v44.37,29.31
PB13  (via drill 0.3)
  Top 0.305: v35.51,8.43 35.51,2.22 J2.12
  Bottom 0.305: U5.26 34.94,9 v35.51,8.43
PB14  (via drill 0.3)
  Top 0.305: v36.25,7.85 36.25,4.02 J2.11
  Bottom 0.305: U5.27 34.44,8.38 35.13,7.7 36.09,7.7 v36.25,7.85
PB15  (via drill 0.3)
  Top 0.305: v37.01,7.26 37.01,5.8 J2.10
  Bottom 0.305: U5.28 33.94,7.82 34.65,7.11 36.85,7.11 v37.01,7.26
PC13  (via drill 0.3)
  Top 0.305: v27.99,27.18 28.27,27.46 48.46,27.46 50.34,29.34 51.79,29.34 53.05,30.6 J1.5
  Bottom 0.305: U5.2 30.44,22.72 29.06,24.11 29.06,26.11 v27.99,27.18
PC14  (via drill 0.3)
  Top 0.305: J1.6 50.62,30.6 48.03,28.02 29.34,28.02 v29.18,28.17
  Bottom 0.305: U5.3 30.94,22.98 30.94,22.99 30.94,23.14 29.62,24.46 29.62,27.74 v29.18,28.17
PC15  (via drill 0.3)
  Top 0.305: J1.7 48.44,29.34 47.68,28.57 30.18,28.57 v30.02,28.73
  Bottom 0.305: U5.4 31.44,23.48 30.18,24.74 30.18,28.57 v30.02,28.73
RESET  (via drill 0.3)
  Top 0.305: 44.96,24.89 36.32,24.89 35.76,24.33 35.76,19.28 v34.95,18.47 | 44.96,24.89 45.97,24.89 | 45.97,24.89 47.27,24.89 | 47.27,24.89 48.21,24.89 | 48.46,24.89 50.77,24.89 | 50.77,24.89 51.69,24.89 | 51.69,24.89 52.24,24.89 R9.1 | RST.2 47.22,24.84 47.27,24.89 | C5.1 44.91,24.84 44.96,24.89 | v51.51,25.63 51.51,25.07 51.69,24.89 | 45.97,24.89 46.46,24.41 47.98,24.41 48.46,24.89 | 48.46,24.89 48.21,24.89 | 48.21,24.89 47.98,24.66 46.41,24.66 | 50.77,24.89 v51.51,25.63 | v51.51,25.63 51.77,25.38 52.43,25.38 52.17,25.12 51.16,25.12
  Bottom 0.305: v51.51,25.63 53.62,25.63 J1.3 | U5.7 32.94,19.64 33.96,18.62 34.8,18.62 v34.95,18.47
RXD1  (via drill 0.3)
  Top 0.305: J2.3 54.27,6.33 44.42,6.33 36.47,14.28 34.09,14.28 33.55,14.81 32.77,14.81 v32.26,14.3
  Bottom 0.305: R37.1 24.28,9.14 31.37,9.14 32.44,10.21 U5.31 32.44,14.12 v32.26,14.3
SWCK  (via drill 0.3)
  Top 0.305: J3.2 26.39,29.11 26.39,14.45 v26.75,14.1
  Bottom 0.305: U5.37 26.92,14.27 v26.75,14.1
SWIO  (via drill 0.3)
  Top 0.305: J3.3 29.87,30.61 27.03,27.76 27.03,16.2 29.03,14.2 v31.14,14.2
  Bottom 0.305: U5.34 30.94,14 v31.14,14.2
TXD1  (via drill 0.3)
  Top 0.305: J2.4 52.28,5.77 44.09,5.77 36.14,13.72 33.5,13.72 v33.12,14.1
  Bottom 0.305: v33.12,14.1 32.94,13.89 U5.30 32.94,9.78 31.65,8.48 24.28,8.48 R38.1
VBAT
  Bottom 0.254: BAT.1 8.95,30.56 8.94,30.56
  Bottom 0.61: BAT.1 9.56,30.05 10.69,30.05 | 10.69,30.05 C25.1 12.78,30.05 | 12.78,30.05 C20.1 C24.1 15.72,30.05 U6.5 | Q7.3 12.78,30.05 | Q10.2 10.68,30.03 10.69,30.05 | 10.69,26.7 10.26,26.7 10.26,28.55 8.53,30.28 8.53,30.99 8.81,31.27 9.63,31.27 10.62,30.28 15.8,30.28 16.18,30.66 16.18,31.19 16.56,31.19 16.56,30.25 16,29.69 13.97,29.69 13.31,29.03 13.31,28.37 11.35,28.37 10.69,27.71 10.77,27.64 | 10.77,27.64 10.77,26.67 | 10.77,27.64 10.77,28.73 8.94,30.56 8.89,30.61 8.89,30.68 9.09,30.89 9.27,30.89 10.49,29.67 13.08,29.67 | 13.46,29.67 13.08,29.67 | 13.08,29.67 12.19,28.78 11.1,28.78 11.1,29.31 13.44,29.31 13.46,29.29
VBUS  (via drill 0.3)  (2 unrouted)
  Top 0.254: 12.8,28.68 12.8,28.7
  Top 0.61: USB-NATIVE.VBUS2 7.91,18.94 v7.92,18.92 | USB-NATIVE.VBUS1 v7.91,23.84 v7.92,23.82 11.88,27.78 | D8.A D9.A 11.88,27.78 | v20.98,30.79 20.98,29.13 20.55,28.7 12.8,28.7 11.88,27.78 | 11.89,30.15 11.89,29.59 12.8,28.68 12.27,28.68 12.09,28.85
  Bottom 0.254: 16.48,22.71 16.36,22.58 C170.1
  Bottom 0.61: v7.92,23.82 v7.92,18.92 8.1,18.75 C9.2 | C9.2 C14.2 | C23.2 C171.1 | C23.2 10.91,18.73 Q13.2 12.51,19.68 | C23.2 C9.2 | 12.51,19.68 C1.1 Q6.3 14.88,20.24 15.77,21.13 | U6.4 16.46,22.76 C170.1 15.77,22.07 15.77,21.13 | C2.1 C19.1 21.64,30.12 v20.98,30.79 U6.8 | Q8.2 18.95,14.96 C18.1 17.89,14.95 Q1.2 15.77,15.49 15.77,18.52 | 15.77,18.52 14.61,19.68 12.51,19.68 | 15.77,20.45 15.77,18.52 | 15.77,21.13 15.77,20.45 | 15.77,20.45 15.09,19.76 15.14,19.76 15.72,19.18 | 15.57,20.34 15.49,20.42 8.43,20.42 8.13,20.73 8.13,23.85 7.8,23.85 7.8,18.87 7.92,18.75 12.45,18.75 13.44,19.74 13.08,20.09 8.15,20.09 8.66,19.58 12.45,19.58 12.17,19.3 8,19.3 | U6.8 21.06,30.79 21.61,31.34 | 16.48,25.25 16.48,22.71 14.1,20.32 13.64,20.32 13.64,20.37 16.15,22.89 16.15,25.25 16.48,25.25
VBUS1  (via drill 0.3)
  Top 0.254: 6.47,12.17 USB-TTL.VBUS1
  Top 0.61: USB-TTL.VBUS2 v7.54,7.27 v7.54,7.26 | 6.47,12.17 v7.54,12.17
  Bottom 0.61: 8.43,7.26 v7.54,7.26 7.54,8.15 | 8.43,7.26 C30.2 C31.2 | 7.54,10.74 v7.54,12.17 8.46,12.17 | 7.54,10.74 7.54,8.15 | 8.46,12.17 9.11,12.17 Q12.2 10.01,13.06 10.01,12.34 | C4.1 8.46,12.17 | C13.1 10.01,12.34 | Q1.3 14.87,12.34 11.05,12.34 | 11.05,12.34 10.01,12.34 | 7.54,8.15 8.43,7.26 | 7.54,10.74 7.98,11.18 10.16,11.18 10.16,11.46 11.05,12.34 | 11.05,12.34 10.24,13.16 10.24,12.52 9.4,11.68 7.9,11.68 7.87,11.71
VDD  (via drill 0.3)
  Top 0.61: J2.1 58.61,7.06 44.98,7.06 37.8,14.25 36.98,15.06 34.44,15.06 33.91,15.6 29.03,15.6 28.07,16.56 v28.07,20.95 | v25.6,20.95 22.86,20.95 | 22.86,20.95 17.22,20.95 | 17.22,20.95 16.79,20.95 | 16.79,20.95 v12.09,25.65 | v22.76,21.26 22.76,21.06 22.86,20.95 | 16.79,20.95 16.82,20.92 v16.82,19.99 | 16.84,20.57 17.22,20.95
  Bottom 0.61: Q7.2 11.83,25.92 v12.09,25.65 Q11.2 | v16.82,19.99 Q6.2 16.82,17.55 Q9.2 | v25.6,20.95 v28.07,20.95 | C7.1 22.76,20.57 v22.76,21.26 22.76,22.05 U4.3
XI
  Bottom 0.305: U5.5 C70.2 31.31,24.89 X1.3
XO
  Bottom 0.305: 33.93,26.87 33.93,24.18 32.44,22.69 U5.6 | 33.93,26.87 X1.1 | C69.1 34.19,27.12 33.93,26.87

### Text on the board
tPlace: - | +
bPlace: PB12 | PB11 | - | PB10 | PA3 | PA2 | PC15 | PC14 | PC13 | GND | RST | GND | 3V3 | + | X1 | U5 | www.makerfabs.com | UWB AOA with Display | STM32F103C8T6 V1.1 | PB13 | PB14 | PB15 | DM | DP | SCL | SDA | PA15 | TXD | RXD | GND | VDD
tNames: +3V3 | +3V3 | SWCK | SWIO | GND | GND | WAUP | RSTN | SCK | MOSI | MISO | NSS | IRQ | LEDRX | LEDTX | NC | NC | SYSNC | +3V3 | +3V3 | EXTON
bNames: G | +3V3 | SWCK | SWIO | SCK | MOSI | MISO | NSS | IRQ | LEDRX | LEDTX | NC | NC | SYSNC | +3V3 | +3V3